# Altium schematic sheet 单片机.SchDoc
size A3; SheetNumber: 1; SheetTotal: 7
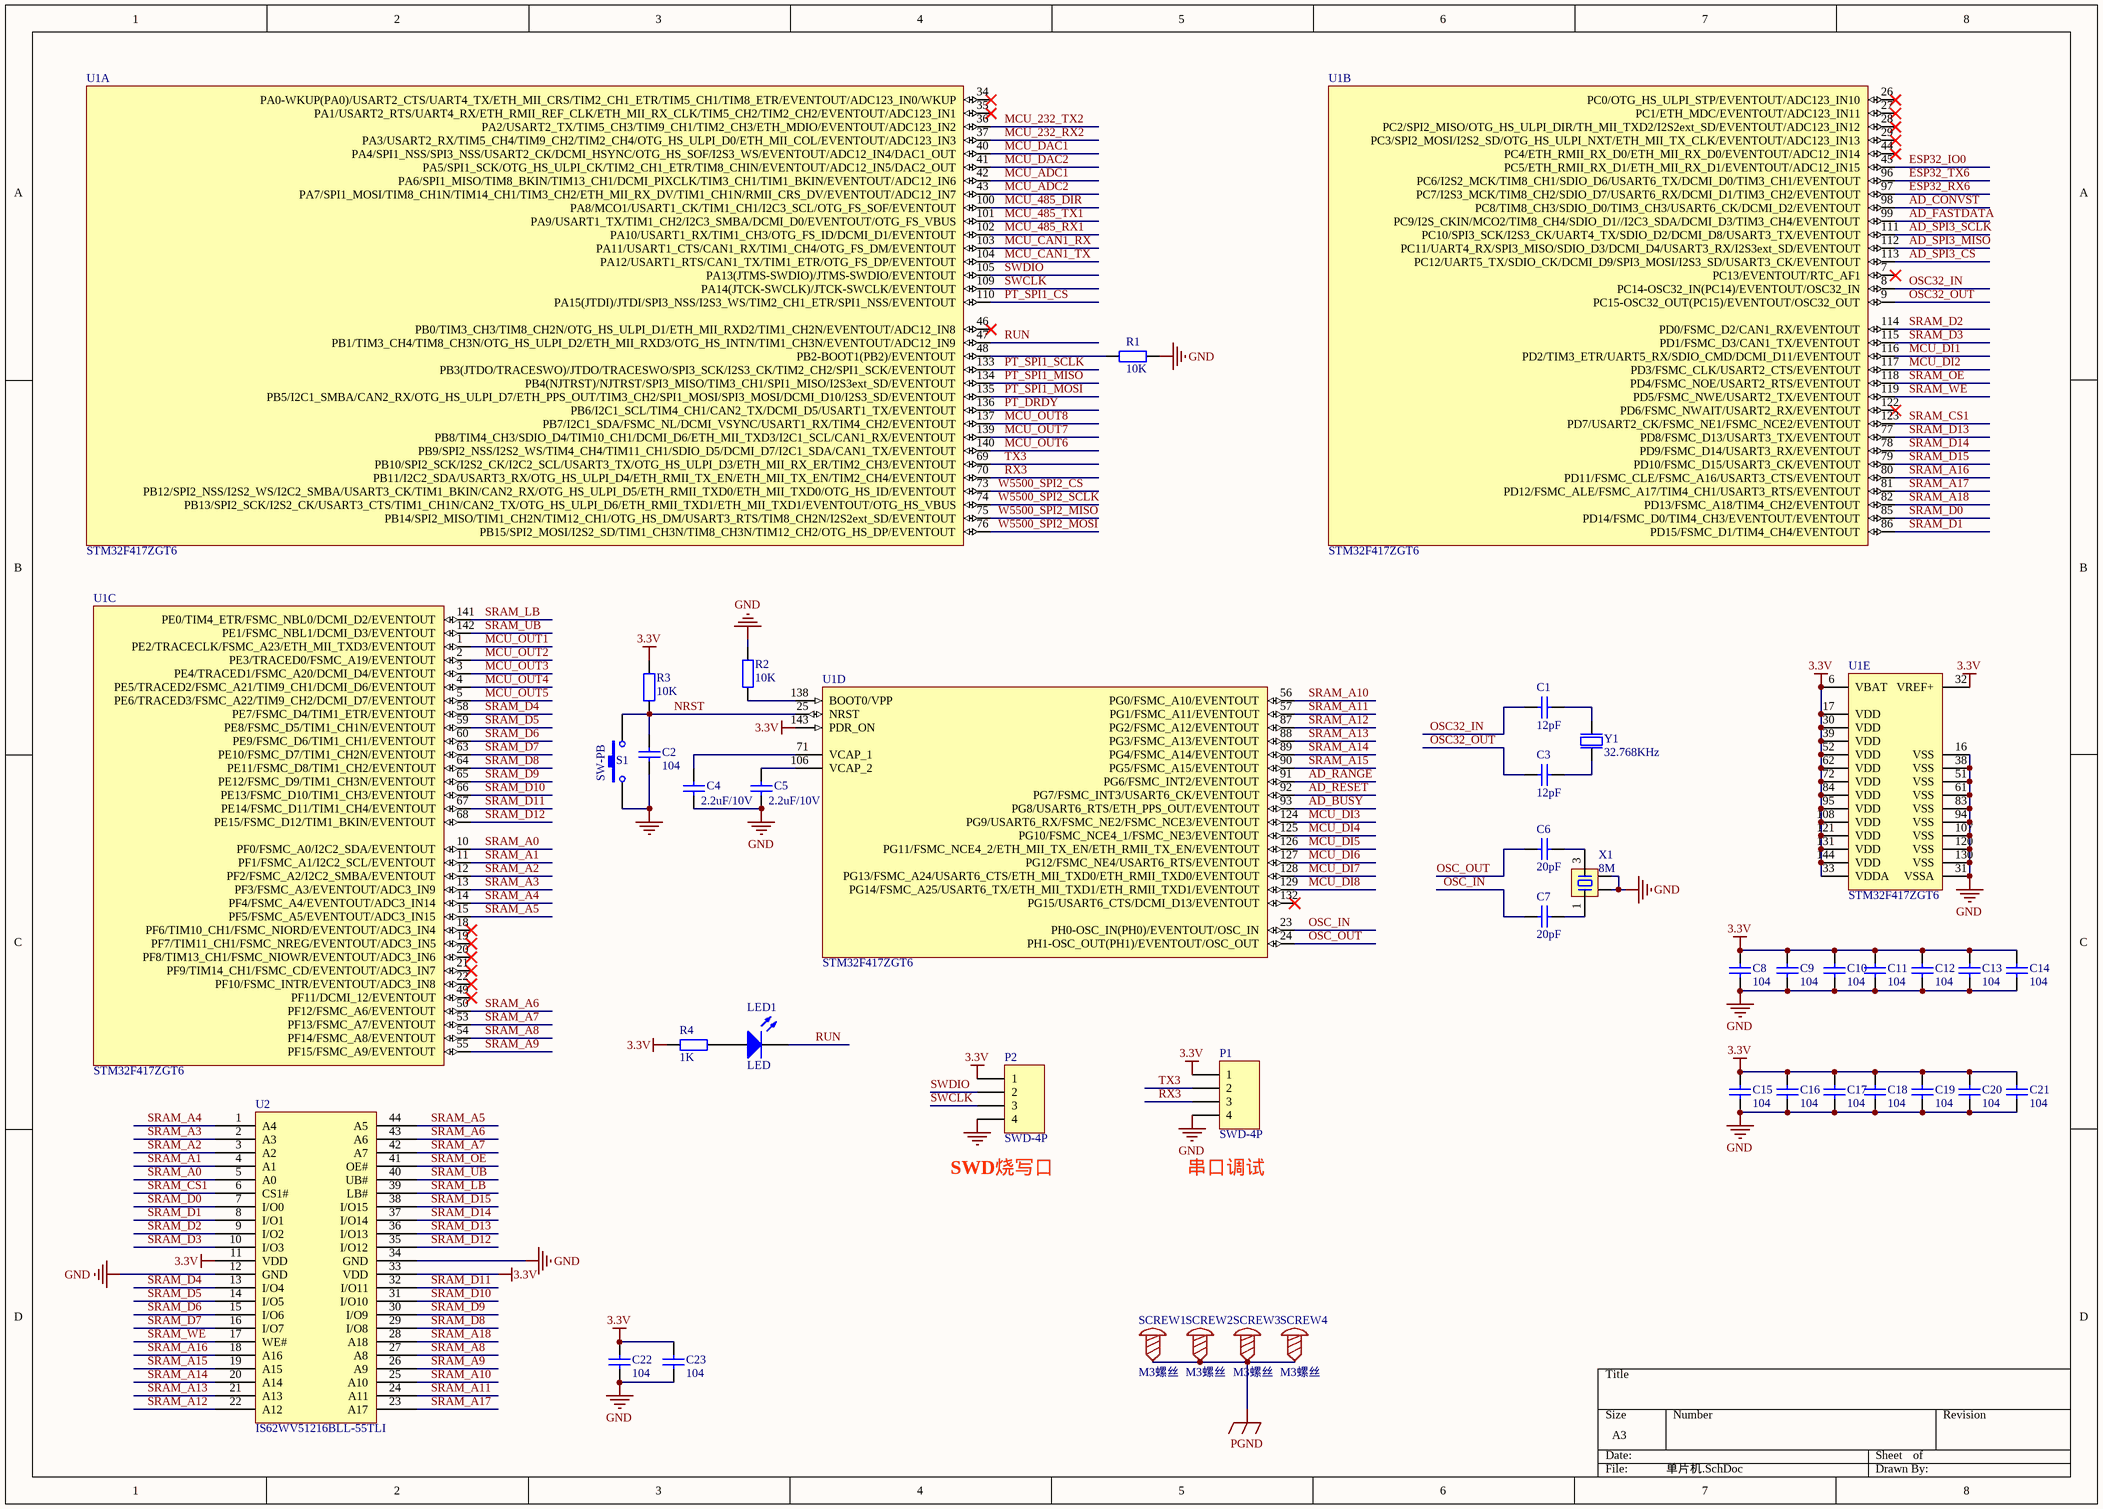
[diagram p0: 单片机.SchDoc]

## Parts
C1  12pF  [C 0603_L]
C2  104  [C 0603_L]
C3  12pF  [C 0603_L]
C4  2.2uF/10V  [C 0603_L]
C5  2.2uF/10V  [C 0603_L]
C6  20pF  [C 0603_L]
C7  20pF  [C 0603_L]
C8  104  [C 0603_L]
C9  104  [C 0603_L]
C10  104  [C 0603_L]
C11  104  [C 0603_L]
C12  104  [C 0603_L]
C13  104  [C 0603_L]
C14  104  [C 0603_L]
C15  104  [C 0603_L]
C16  104  [C 0603_L]
C17  104  [C 0603_L]
C18  104  [C 0603_L]
C19  104  [C 0603_L]
C20  104  [C 0603_L]
C21  104  [C 0603_L]
C22  104  [C 0603_L]
C23  104  [C 0603_L]
LED1  LED  [LED 0603R]
P1  SWD-4P  [DB-1X4]
P2  SWD-4P  [DB-1X4]
R1  10K  [R 0603_L]
R2  10K  [R 0603_L]
R3  10K  [R 0603_L]
R4  1K  [R 0603_L]
S1  SW-PB  [轻触按键3*4]
SCREW1  M3螺丝  [螺丝孔]
SCREW2  M3螺丝  [螺丝孔]
SCREW3  M3螺丝  [螺丝孔]
SCREW4  M3螺丝  [螺丝孔]
U1  STM32F417ZGT6  [LQFP144 20X20_M]  (parts A,B,C,D,E of 5)
U2  IS62WV51216BLL-55TLI  [TSOP-44_L18.4-W10.2-P0.80-LS11.8-BL]
X1  8M  [OSC 3225-4P]
Y1  32.768KHz  [OSC 3215-2P]

## Nets
3.3V: C8.2 C9.2 C10.2 C11.2 C12.2 C13.2 C14.2 C15.2 C16.2 C17.2 C18.2 C19.2 C20.2 C21.2 C22.2 C23.2 P1.1 P2.1 R3.2 R4.1 U1.6(VBAT) U1.17(VDD) U1.30(VDD) U1.32(VREF+) U1.33(VDDA) U1.39(VDD) U1.52(VDD) U1.62(VDD) U1.72(VDD) U1.84(VDD) U1.95(VDD) U1.108(VDD) U1.121(VDD) U1.131(VDD) U1.143(PDR_ON) U1.144(VDD) U2.11(VDD) U2.33(VDD)
GND: C2.1 C4.2 C5.2 C8.1 C9.1 C10.1 C11.1 C12.1 C13.1 C14.1 C15.1 C16.1 C17.1 C18.1 C19.1 C20.1 C21.1 C22.1 C23.1 P1.4 P2.4 R1.1 R2.2 S1.1 U1.16(VSS) U1.31(VSSA) U1.38(VSS) U1.51(VSS) U1.61(VSS) U1.83(VSS) U1.94(VSS) U1.107(VSS) U1.120(VSS) U1.130(VSS) U2.12(GND) U2.34(GND) X1.2 X1.4
PGND: SCREW1.1 SCREW2.1 SCREW3.1 SCREW4.1
AD_BUSY: U1.93(PG8/USART6_RTS/ETH_PPS_OUT/EVENTOUT)
AD_CONVST: U1.98(PC8/TIM8_CH3/SDIO_D0/TIM3_CH3/USART6_CK/DCMI_D2/EVENTOUT)
AD_FASTDATA: U1.99(PC9/I2S_CKIN/MCO2/TIM8_CH4/SDIO_D1//I2C3_SDA/DCMI_D3/TIM3_CH4/EVENTOUT)
AD_RANGE: U1.91(PG6/FSMC_INT2/EVENTOUT)
AD_RESET: U1.92(PG7/FSMC_INT3/USART6_CK/EVENTOUT)
AD_SPI3_CS: U1.113(PC12/UART5_TX/SDIO_CK/DCMI_D9/SPI3_MOSI/I2S3_SD/USART3_CK/EVENTOUT)
AD_SPI3_MISO: U1.112(PC11/UART4_RX/SPI3_MISO/SDIO_D3/DCMI_D4/USART3_RX/I2S3ext_SD/EVENTOUT)
AD_SPI3_SCLK: U1.111(PC10/SPI3_SCK/I2S3_CK/UART4_TX/SDIO_D2/DCMI_D8/USART3_TX/EVENTOUT)
ESP32_IO0: U1.45(PC5/ETH_RMII_RX_D1/ETH_MII_RX_D1/EVENTOUT/ADC12_IN15)
ESP32_RX6: U1.97(PC7/I2S3_MCK/TIM8_CH2/SDIO_D7/USART6_RX/DCMI_D1/TIM3_CH2/EVENTOUT)
ESP32_TX6: U1.96(PC6/I2S2_MCK/TIM8_CH1/SDIO_D6/USART6_TX/DCMI_D0/TIM3_CH1/EVENTOUT)
MCU_232_RX2: U1.37(PA3/USART2_RX/TIM5_CH4/TIM9_CH2/TIM2_CH4/OTG_HS_ULPI_D0/ETH_MII_COL/EVENTOUT/ADC123_IN3)
MCU_232_TX2: U1.36(PA2/USART2_TX/TIM5_CH3/TIM9_CH1/TIM2_CH3/ETH_MDIO/EVENTOUT/ADC123_IN2)
MCU_485_DIR: U1.100(PA8/MCO1/USART1_CK/TIM1_CH1/I2C3_SCL/OTG_FS_SOF/EVENTOUT)
MCU_485_RX1: U1.102(PA10/USART1_RX/TIM1_CH3/OTG_FS_ID/DCMI_D1/EVENTOUT)
MCU_485_TX1: U1.101(PA9/USART1_TX/TIM1_CH2/I2C3_SMBA/DCMI_D0/EVENTOUT/OTG_FS_VBUS)
MCU_ADC1: U1.42(PA6/SPI1_MISO/TIM8_BKIN/TIM13_CH1/DCMI_PIXCLK/TIM3_CH1/TIM1_BKIN/EVENTOUT/ADC12_IN6)
MCU_ADC2: U1.43(PA7/SPI1_MOSI/TIM8_CH1N/TIM14_CH1/TIM3_CH2/ETH_MII_RX_DV/TIM1_CH1N/RMII_CRS_DV/EVENTOUT/ADC12_IN7)
MCU_CAN1_RX: U1.103(PA11/USART1_CTS/CAN1_RX/TIM1_CH4/OTG_FS_DM/EVENTOUT)
MCU_CAN1_TX: U1.104(PA12/USART1_RTS/CAN1_TX/TIM1_ETR/OTG_FS_DP/EVENTOUT)
MCU_DAC1: U1.40(PA4/SPI1_NSS/SPI3_NSS/USART2_CK/DCMI_HSYNC/OTG_HS_SOF/I2S3_WS/EVENTOUT/ADC12_IN4/DAC1_OUT)
MCU_DAC2: U1.41(PA5/SPI1_SCK/OTG_HS_ULPI_CK/TIM2_CH1_ETR/TIM8_CHIN/EVENTOUT/ADC12_IN5/DAC2_OUT)
MCU_DI1: U1.116(PD2/TIM3_ETR/UART5_RX/SDIO_CMD/DCMI_D11/EVENTOUT)
MCU_DI2: U1.117(PD3/FSMC_CLK/USART2_CTS/EVENTOUT)
MCU_DI3: U1.124(PG9/USART6_RX/FSMC_NE2/FSMC_NCE3/EVENTOUT)
MCU_DI4: U1.125(PG10/FSMC_NCE4_1/FSMC_NE3/EVENTOUT)
MCU_DI5: U1.126(PG11/FSMC_NCE4_2/ETH_MII_TX_EN/ETH_RMII_TX_EN/EVENTOUT)
MCU_DI6: U1.127(PG12/FSMC_NE4/USART6_RTS/EVENTOUT)
MCU_DI7: U1.128(PG13/FSMC_A24/USART6_CTS/ETH_MII_TXD0/ETH_RMII_TXD0/EVENTOUT)
MCU_DI8: U1.129(PG14/FSMC_A25/USART6_TX/ETH_MII_TXD1/ETH_RMII_TXD1/EVENTOUT)
MCU_OUT1: U1.1(PE2/TRACECLK/FSMC_A23/ETH_MII_TXD3/EVENTOUT)
MCU_OUT2: U1.2(PE3/TRACED0/FSMC_A19/EVENTOUT)
MCU_OUT3: U1.3(PE4/TRACED1/FSMC_A20/DCMI_D4/EVENTOUT)
MCU_OUT4: U1.4(PE5/TRACED2/FSMC_A21/TIM9_CH1/DCMI_D6/EVENTOUT)
MCU_OUT5: U1.5(PE6/TRACED3/FSMC_A22/TIM9_CH2/DCMI_D7/EVENTOUT)
MCU_OUT6: U1.140(PB9/SPI2_NSS/I2S2_WS/TIM4_CH4/TIM11_CH1/SDIO_D5/DCMI_D7/I2C1_SDA/CAN1_TX/EVENTOUT)
MCU_OUT7: U1.139(PB8/TIM4_CH3/SDIO_D4/TIM10_CH1/DCMI_D6/ETH_MII_TXD3/I2C1_SCL/CAN1_RX/EVENTOUT)
MCU_OUT8: U1.137(PB7/I2C1_SDA/FSMC_NL/DCMI_VSYNC/USART1_RX/TIM4_CH2/EVENTOUT)
NRST: C2.2 R3.1 S1.2 U1.25(NRST)
OSC32_IN: C1.2 U1.8(PC14-OSC32_IN(PC14)/EVENTOUT/OSC32_IN)
OSC32_OUT: C3.2 U1.9(PC15-OSC32_OUT(PC15)/EVENTOUT/OSC32_OUT)
OSC_IN: C7.2 U1.23(PH0-OSC_IN(PH0)/EVENTOUT/OSC_IN)
OSC_OUT: C6.2 U1.24(PH1-OSC_OUT(PH1)/EVENTOUT/OSC_OUT)
PT_DRDY: U1.136(PB6/I2C1_SCL/TIM4_CH1/CAN2_TX/DCMI_D5/USART1_TX/EVENTOUT)
PT_SPI1_CS: U1.110(PA15(JTDI)/JTDI/SPI3_NSS/I2S3_WS/TIM2_CH1_ETR/SPI1_NSS/EVENTOUT)
PT_SPI1_MISO: U1.134(PB4(NJTRST)/NJTRST/SPI3_MISO/TIM3_CH1/SPI1_MISO/I2S3ext_SD/EVENTOUT)
PT_SPI1_MOSI: U1.135(PB5/I2C1_SMBA/CAN2_RX/OTG_HS_ULPI_D7/ETH_PPS_OUT/TIM3_CH2/SPI1_MOSI/SPI3_MOSI/DCMI_D10/I2S3_SD/EVENTOUT)
PT_SPI1_SCLK: U1.133(PB3(JTDO/TRACESWO)/JTDO/TRACESWO/SPI3_SCK/I2S3_CK/TIM2_CH2/SPI1_SCK/EVENTOUT)
RUN: LED1.2(K) U1.47(PB1/TIM3_CH4/TIM8_CH3N/OTG_HS_ULPI_D2/ETH_MII_RXD3/OTG_HS_INTN/TIM1_CH3N/EVENTOUT/ADC12_IN9)
RX3: P1.3 U1.70(PB11/I2C2_SDA/USART3_RX/OTG_HS_ULPI_D4/ETH_RMII_TX_EN/ETH_MII_TX_EN/TIM2_CH4/EVENTOUT)
SRAM_A0: U1.10(PF0/FSMC_A0/I2C2_SDA/EVENTOUT) U2.5(A0)
SRAM_A1: U1.11(PF1/FSMC_A1/I2C2_SCL/EVENTOUT) U2.4(A1)
SRAM_A2: U1.12(PF2/FSMC_A2/I2C2_SMBA/EVENTOUT) U2.3(A2)
SRAM_A3: U1.13(PF3/FSMC_A3/EVENTOUT/ADC3_IN9) U2.2(A3)
SRAM_A4: U1.14(PF4/FSMC_A4/EVENTOUT/ADC3_IN14) U2.1(A4)
SRAM_A5: U1.15(PF5/FSMC_A5/EVENTOUT/ADC3_IN15) U2.44(A5)
SRAM_A6: U1.50(PF12/FSMC_A6/EVENTOUT) U2.43(A6)
SRAM_A7: U1.53(PF13/FSMC_A7/EVENTOUT) U2.42(A7)
SRAM_A8: U1.54(PF14/FSMC_A8/EVENTOUT) U2.27(A8)
SRAM_A9: U1.55(PF15/FSMC_A9/EVENTOUT) U2.26(A9)
SRAM_A10: U1.56(PG0/FSMC_A10/EVENTOUT) U2.25(A10)
SRAM_A11: U1.57(PG1/FSMC_A11/EVENTOUT) U2.24(A11)
SRAM_A12: U1.87(PG2/FSMC_A12/EVENTOUT) U2.22(A12)
SRAM_A13: U1.88(PG3/FSMC_A13/EVENTOUT) U2.21(A13)
SRAM_A14: U1.89(PG4/FSMC_A14/EVENTOUT) U2.20(A14)
SRAM_A15: U1.90(PG5/FSMC_A15/EVENTOUT) U2.19(A15)
SRAM_A16: U1.80(PD11/FSMC_CLE/FSMC_A16/USART3_CTS/EVENTOUT) U2.18(A16)
SRAM_A17: U1.81(PD12/FSMC_ALE/FSMC_A17/TIM4_CH1/USART3_RTS/EVENTOUT) U2.23(A17)
SRAM_A18: U1.82(PD13/FSMC_A18/TIM4_CH2/EVENTOUT) U2.28(A18)
SRAM_CS1: U1.123(PD7/USART2_CK/FSMC_NE1/FSMC_NCE2/EVENTOUT) U2.6(CS1#)
SRAM_D0: U1.85(PD14/FSMC_D0/TIM4_CH3/EVENTOUT/EVENTOUT) U2.7(I/O0)
SRAM_D1: U1.86(PD15/FSMC_D1/TIM4_CH4/EVENTOUT) U2.8(I/O1)
SRAM_D2: U1.114(PD0/FSMC_D2/CAN1_RX/EVENTOUT) U2.9(I/O2)
SRAM_D3: U1.115(PD1/FSMC_D3/CAN1_TX/EVENTOUT) U2.10(I/O3)
SRAM_D4: U1.58(PE7/FSMC_D4/TIM1_ETR/EVENTOUT) U2.13(I/O4)
SRAM_D5: U1.59(PE8/FSMC_D5/TIM1_CH1N/EVENTOUT) U2.14(I/O5)
SRAM_D6: U1.60(PE9/FSMC_D6/TIM1_CH1/EVENTOUT) U2.15(I/O6)
SRAM_D7: U1.63(PE10/FSMC_D7/TIM1_CH2N/EVENTOUT) U2.16(I/O7)
SRAM_D8: U1.64(PE11/FSMC_D8/TIM1_CH2/EVENTOUT) U2.29(I/O8)
SRAM_D9: U1.65(PE12/FSMC_D9/TIM1_CH3N/EVENTOUT) U2.30(I/O9)
SRAM_D10: U1.66(PE13/FSMC_D10/TIM1_CH3/EVENTOUT) U2.31(I/O10)
SRAM_D11: U1.67(PE14/FSMC_D11/TIM1_CH4/EVENTOUT) U2.32(I/O11)
SRAM_D12: U1.68(PE15/FSMC_D12/TIM1_BKIN/EVENTOUT) U2.35(I/O12)
SRAM_D13: U1.77(PD8/FSMC_D13/USART3_TX/EVENTOUT) U2.36(I/O13)
SRAM_D14: U1.78(PD9/FSMC_D14/USART3_RX/EVENTOUT) U2.37(I/O14)
SRAM_D15: U1.79(PD10/FSMC_D15/USART3_CK/EVENTOUT) U2.38(I/O15)
SRAM_LB: U1.141(PE0/TIM4_ETR/FSMC_NBL0/DCMI_D2/EVENTOUT) U2.39(LB#)
SRAM_OE: U1.118(PD4/FSMC_NOE/USART2_RTS/EVENTOUT) U2.41(OE#)
SRAM_UB: U1.142(PE1/FSMC_NBL1/DCMI_D3/EVENTOUT) U2.40(UB#)
SRAM_WE: U1.119(PD5/FSMC_NWE/USART2_TX/EVENTOUT) U2.17(WE#)
SWCLK: P2.3 U1.109(PA14(JTCK-SWCLK)/JTCK-SWCLK/EVENTOUT)
SWDIO: P2.2 U1.105(PA13(JTMS-SWDIO)/JTMS-SWDIO/EVENTOUT)
TX3: P1.2 U1.69(PB10/SPI2_SCK/I2S2_CK/I2C2_SCL/USART3_TX/OTG_HS_ULPI_D3/ETH_MII_RX_ER/TIM2_CH3/EVENTOUT)
W5500_SPI2_CS: U1.73(PB12/SPI2_NSS/I2S2_WS/I2C2_SMBA/USART3_CK/TIM1_BKIN/CAN2_RX/OTG_HS_ULPI_D5/ETH_RMII_TXD0/ETH_MII_TXD0/OTG_HS_ID/EVENTOUT)
W5500_SPI2_MISO: U1.75(PB14/SPI2_MISO/TIM1_CH2N/TIM12_CH1/OTG_HS_DM/USART3_RTS/TIM8_CH2N/I2S2ext_SD/EVENTOUT)
W5500_SPI2_MOSI: U1.76(PB15/SPI2_MOSI/I2S2_SD/TIM1_CH3N/TIM8_CH3N/TIM12_CH2/OTG_HS_DP/EVENTOUT)
W5500_SPI2_SCLK: U1.74(PB13/SPI2_SCK/I2S2_CK/USART3_CTS/TIM1_CH1N/CAN2_TX/OTG_HS_ULPI_D6/ETH_RMII_TXD1/ETH_MII_TXD1/EVENTOUT/OTG_HS_VBUS)
NetC1_1: C1.1 Y1.2(out)
NetC3_1: C3.1 Y1.1(inp)
NetC4_1: C4.1 U1.71(VCAP_1)
NetC5_1: C5.1 U1.106(VCAP_2)
NetC6_1: C6.1 X1.3
NetC7_1: C7.1 X1.1
NetLED1_1: LED1.1(A) R4.2
NetR1_2: R1.2 U1.48(PB2-BOOT1(PB2)/EVENTOUT)
NetR2_1: R2.1 U1.138(BOOT0/VPP)

Not connected (* = marked no-connect by the designer): U1 7(PC13/EVENTOUT/RTC_AF1)* 18(PF6/TIM10_CH1/FSMC_NIORD/EVENTOUT/ADC3_IN4)* 19(PF7/TIM11_CH1/FSMC_NREG/EVENTOUT/ADC3_IN5)* 20(PF8/TIM13_CH1/FSMC_NIOWR/EVENTOUT/ADC3_IN6)* 21(PF9/TIM14_CH1/FSMC_CD/EVENTOUT/ADC3_IN7)* 22(PF10/FSMC_INTR/EVENTOUT/ADC3_IN8)* 26(PC0/OTG_HS_ULPI_STP/EVENTOUT/ADC123_IN10)* 27(PC1/ETH_MDC/EVENTOUT/ADC123_IN11)* 28(PC2/SPI2_MISO/OTG_HS_ULPI_DIR/TH_MII_TXD2/I2S2ext_SD/EVENTOUT/ADC123_IN12)* 29(PC3/SPI2_MOSI/I2S2_SD/OTG_HS_ULPI_NXT/ETH_MII_TX_CLK/EVENTOUT/ADC123_IN13)* 34(PA0-WKUP(PA0)/USART2_CTS/UART4_TX/ETH_MII_CRS/TIM2_CH1_ETR/TIM5_CH1/TIM8_ETR/EVENTOUT/ADC123_IN0/WKUP)* 35(PA1/USART2_RTS/UART4_RX/ETH_RMII_REF_CLK/ETH_MII_RX_CLK/TIM5_CH2/TIM2_CH2/EVENTOUT/ADC123_IN1)* 44(PC4/ETH_RMII_RX_D0/ETH_MII_RX_D0/EVENTOUT/ADC12_IN14)* 46(PB0/TIM3_CH3/TIM8_CH2N/OTG_HS_ULPI_D1/ETH_MII_RXD2/TIM1_CH2N/EVENTOUT/ADC12_IN8)* 49(PF11/DCMI_12/EVENTOUT)* 122(PD6/FSMC_NWAIT/USART2_RX/EVENTOUT)* 132(PG15/USART6_CTS/DCMI_D13/EVENTOUT)*

## Notes on the sheet
- (near P2) SWD烧写口
- (near P1) 串口调试

## Library data of the parts
C1-C23 = Cap: 0603贴片电容; Published: 8-Jun-2000; LatestRevisionDate: 17-Jul-2002; LatestRevisionNote: Re-released for DXP Platform.; PackageReference: RAD-0.3; Publisher: Altium Limited; PackageDescription: Radial Cap, Thru-Hole; 2 Leads; 0.3 in Pin Spacing
LED1 = LED: 0603发光二极管; Published: 8-Jun-2000; LatestRevisionDate: 08-Jul-2005; LatestRevisionNote: Mech Layer 1 removed.; PackageReference: LED-0; Publisher: Altium Limited; PackageDescription: LED; 2 Leads
P1 P2 = 2.54排针-4P: LatestRevisionDate: 17-Jul-2002; LatestRevisionNote: Re-released for DXP Platform.; Publisher: Altium Limited
R1 R2 = Res: 0603贴片电阻; BOM名称: 贴片电阻; 版权归属: 源创客; 学习资源: www.ooocke.com
R3 R4 = Res: C0603贴片电阻; BOM名称: 贴片电阻; 版权归属: 源创客; 学习资源: www.ooocke.com
S1 = SW-PB: Switch; Published: 24-Mar-1999; LatestRevisionDate: 17-Jul-2002; LatestRevisionNote: Re-released for DXP Platform.; PackageReference: SPST-2; Publisher: Altium Limited; PackageDescription: Switch; 2 Leads
SCREW1-SCREW4 = M3螺丝: Convert to PCB: yes; Symbol: 螺丝孔; Device: M3螺丝; Add into BOM: yes; Supplier Footprint: 插件
U1 = STM32F417ZGT6: ARM Cortex-M4 32b MCU+FPU, 210DMIP, 1024 kB Flash, 192+4 kB RAM, Crypto, Camera, 114 I/Os, 144-pin LQFP, -40 to +85癈, Tray; Internal RAM: 192kB; Operating Frequency (Processor Speed): 168MHz; A/D Converter: 24x12-bit; D/A Converter: 2x12-bit; 16-bit Timers (IC/OC/PWM): 12x16-bit(24/24/30); 32-bit Timer (IC/OC/PWM): 2x32-bit (8/8/8); Other Timer Functions: 2xWDG, RTC, 24-bit down counter; Serial Interface: 3xSPI/2xI2S/2xI2C/3xUSART(IrDa, ISO7816)/3xUART/2xUSB OTG FS/HS, 2xCAN/Ethernet MAC10/100, SDIO; DatasheetVersion: rev2, Jan-2012; PackageVersion: 2012; PackageReference: TQFP144; PackageDescription: 144-Pin Low Profile Quad Flat Package, 20x20 mm Body, 0.5 mm Pitch; ComponentLink1Description: Manufacturer URL; ComponentLink1URL: http://www.st.com/; ComponentLink2Description: STM32F415/7 Datasheet; ComponentLink2URL: http://www.st.com/internet/com/TECHNICAL_RESOURCES/TECHNICAL_LITERATURE/DATASHEET/DM00035129.pdf; ComponentLink3Description: STM32F4 Web Page; ComponentLink3URL: http://www.st.com/internet/mcu/subclass/1521.jsp
U2 = IS62WV51216BLL-55TLI: Manufacturer: ISSI(美国芯成); Add into BOM: yes; Memory Size: 8Mbit; Voltage - Supply: 2.5V~3.6V; Access Time: 55ns; Supply Current (Icc): 30mA; Standby Current (Iq): 25uA; Symbol: IS62WV51216BLL-55TLI; Device: IS62WV51216BLL-55TLI; LCSC Part Name: 512K X 16 低电压超低功耗CMOS静态RAM; Supplier Part: C11315; Manufacturer Part: IS62WV51216BLL-55TLI; Supplier Footprint: TSOP-44-10.2mm; Datasheet: https://item.szlcsc.com/datasheet/IS62WV51216BLL-55TLI/11868.html; Supplier: LCSC; Convert to PCB: yes; Operating Temperature: -40℃~+85℃
X1 = XTAL-4P: 4脚无源晶振; 版权归属: 封装库来自淘宝卖家 ID：黄晶宝石; BOM名称: 4脚无源晶振; 学习资源: https://shop463601444.taobao.com
Y1 = XTAL_3215: Part Number: XTAL SMD 12MHz (3225); Manufacturer: TXC Corporation; Manufacturer Part Number: 7M-12.000MAAJ-T; 2nd source part number: 184-2056; Value: 12MHz; Note: XTAL SMD 12.000MHz; Artikkelnr Noca: 22019166; Datasheet: http://www.txccrystal.com/images/pdf/7m.pdf; Footprint: BT-XTAL_3225; LatestRevisionDate: 2010-08-31; Pin Count: 4; Publisher: Nordic Semiconductor; Published: 2010-08-31; Supplier: Digi-Key; Supplier part number: 887-1121-1-ND; 2nd source Supplier: Farnell